# EAGLE design AccessControl (EAGLE 7.7.0)
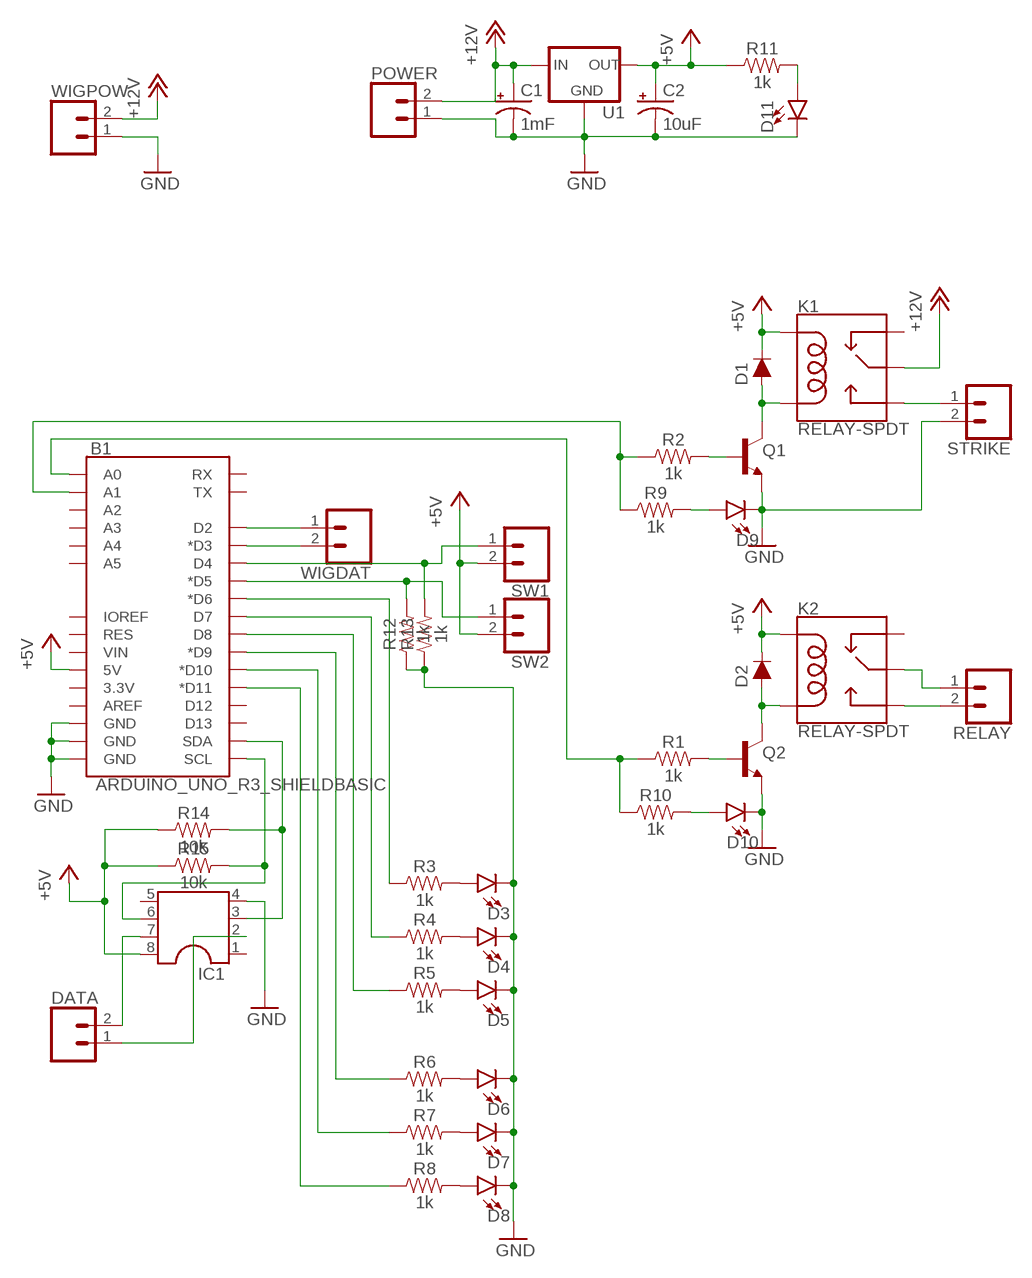
[diagram p0: schematic, sheet 1]

## Parts
B1  ARDUINO_UNO_R3_SHIELDBASIC  [UNO_R3_SHIELD]
C1  1mF  1000UF-RADIAL-5MM-25V-20%  [CPOL-RADIAL-5MM-10MM]
C2  10uF  10UF-POLAR-RADIAL-2.5MM-25V-20%  [CPOL-RADIAL-2.5MM-5MM]
D1  DIODE-KIT2  [DIODE-1N4001-KIT]
D2  DIODE-KIT2  [DIODE-1N4001-KIT]
D3  LED5MM  [LED_5MM]
D4  LED5MM  [LED_5MM]
D5  LED5MM  [LED_5MM]
D6  LED5MM  [LED_5MM]
D7  LED5MM  [LED_5MM]
D8  LED5MM  [LED_5MM]
D9  LED5MM  [LED_5MM]
D10  LED5MM  [LED_5MM]
D11  LED5MM  [LED_5MM]
DATA  CONN_025MM  [SCREWTERMINAL-5MM-2]
IC1  DIL8  [DIL08]
K1  RELAY-SPDT  RELAY-SPDT-JZC-11F  [RELAY-JZC]
K2  RELAY-SPDT  RELAY-SPDT-JZC-11F  [RELAY-JZC]
POWER  CONN_025MM  [SCREWTERMINAL-5MM-2]
Q1  TRANS_NPN-P2N2222A  [TO-92]
Q2  TRANS_NPN-P2N2222A  [TO-92]
R1  1k  1KOHM-VERT-1/6W-5%  [AXIAL-0.1]
R2  1k  1KOHM-VERT-1/6W-5%  [AXIAL-0.1]
R3  1k  1KOHM-VERT-1/6W-5%  [AXIAL-0.1]
R4  1k  1KOHM-VERT-1/6W-5%  [AXIAL-0.1]
R5  1k  1KOHM-VERT-1/6W-5%  [AXIAL-0.1]
R6  1k  1KOHM-VERT-1/6W-5%  [AXIAL-0.1]
R7  1k  1KOHM-VERT-1/6W-5%  [AXIAL-0.1]
R8  1k  1KOHM-VERT-1/6W-5%  [AXIAL-0.1]
R9  1k  1KOHM-VERT-1/6W-5%  [AXIAL-0.1]
R10  1k  1KOHM-VERT-1/6W-5%  [AXIAL-0.1]
R11  1k  1KOHM-VERT-1/6W-5%  [AXIAL-0.1]
R12  1k  1KOHM-VERT-1/6W-5%  [AXIAL-0.1]
R13  1k  1KOHM-VERT-1/6W-5%  [AXIAL-0.1]
R14  10k  10KOHM-VERT-1/6W-5%  [AXIAL-0.1]
R15  10k  10KOHM-VERT-1/6W-5%  [AXIAL-0.1]
RELAY  CONN_025MM  [SCREWTERMINAL-5MM-2]
STRIKE  CONN_025MM  [SCREWTERMINAL-5MM-2]
SW1  CONN_025MM  [SCREWTERMINAL-5MM-2]
SW2  CONN_025MM  [SCREWTERMINAL-5MM-2]
U1  V_REG_78XXSINK  [TO220-IGO]
WIGDAT  CONN_025MM  [SCREWTERMINAL-5MM-2]
WIGPOW  CONN_025MM  [SCREWTERMINAL-5MM-2]

## Nets
+5V: B1.5V C2.1(+) D1.C D2.C IC1.8 K1.5(COIL1) K2.5(COIL1) R11.P$1 R14.P$1 R15.P$1 SW1.2 SW2.2 U1.OUT
+12V: C1.+ K1.4(MAIN) POWER.2 U1.IN WIGPOW.2
GND: B1.GND@0(GND) B1.GND@1(GND) B1.GND@2(GND) C1.- C2.2(-) D3.K(C) D4.K(C) D5.K(C) D6.K(C) D7.K(C) D8.K(C) D9.K(C) D10.K(C) D11.K(C) IC1.4 POWER.1 Q1.3(E) Q2.3(E) R12.P$1 R13.P$1 STRIKE.2 U1.GND WIGPOW.1
N$1: D1.A K1.1(COIL2) Q1.1(C)
N$2: Q1.2(B) R2.P$2
N$3: D2.A K2.1(COIL2) Q2.1(C)
N$4: Q2.2(B) R1.P$2
N$5: K2.3(NO) RELAY.2
N$6: K2.4(MAIN) RELAY.1
N$7: K1.3(NO) STRIKE.1
N$8: B1.D2 WIGDAT.1
N$9: B1.D3(*D3) WIGDAT.2
N$10: B1.A0 R1.P$1 R10.P$1
N$11: B1.A1 R2.P$1 R9.P$1
N$12: D3.A R3.P$2
N$13: D4.A R4.P$2
N$14: D5.A R5.P$2
N$15: D6.A R6.P$2
N$16: D7.A R7.P$2
N$17: D8.A R8.P$2
N$18: D11.A R11.P$2
N$19: D9.A R9.P$2
N$20: D10.A R10.P$2
N$21: B1.D6(*D6) R3.P$1
N$22: B1.D7 R4.P$1
N$23: B1.D8 R5.P$1
N$24: B1.D9(*D9) R6.P$1
N$25: B1.D10(*D10) R7.P$1
N$26: B1.D11(*D11) R8.P$1
N$27: B1.SDA IC1.3 R14.P$2
N$28: B1.D4 R13.P$2 SW1.1
N$29: B1.D5(*D5) R12.P$2 SW2.1
N$30: B1.SCL IC1.6 R15.P$2
N$33: DATA.2 IC1.7
N$34: DATA.1 IC1.2
Unconnected: B1.3.3V B1.A2 B1.A3 B1.A4 B1.A5 B1.AREF B1.D12 B1.D13 B1.IOREF B1.RES B1.RX B1.TX B1.VIN IC1.1 IC1.5 K1.2(NC) K2.2(NC)

## Library data of the parts
B1 = SparkFun-Boards:ARDUINO_UNO_R3_SHIELD: Arduino R3 Shield Footprint Shield form compatible with the Arduino Uno R3. SparkFun Products: MG2639 Cellular Shield <https://www.sparkfun.com/products/13120> MIDI Shield <https://www.sparkfun.com/products/12898> R3 Stackable Headers Kit <https://www.sparkfun.com/products/11417>
C1 = SparkFun-Capacitors:1000UF: 1,000µF/1mF ceramic capacitors A capacitor is a passive two-terminal electrical component used to store electrical energy temporarily in an electric field. CAP-08070; PROD_ID: CAP-09538
C2 = SparkFun-Capacitors:10UF-POLAR: 10.0µF polarized capacitors A capacitor is a passive two-terminal electrical component used to store electrical energy temporarily in an electric field.; PROD_ID: CAP-08440
D1 D2 = SparkFun-DiscreteSemi:DIODE: Diode These are standard reverse protection diodes and small signal diodes. SparkFun Products: SparkFun SparkPunk Sound Kit <https://www.sparkfun.com/products/11177> SparkFun ESP8266 Thing <https://www.sparkfun.com/products/13231>; PROD_ID: DIO-09176; VALUE: 1A/50V/1.1V
D3-D11 = SparkFun-LED:LED: LED (Generic) Standard schematic elements and footprints for 5mm, 3mm, 1206, and 0603 sized LEDs. Generic LEDs with no color specified.
DATA POWER RELAY STRIKE SW1 SW2 WIGDAT WIGPOW = SparkFun-Connectors:CONN_02: Multi connection point. Often used as Generic Header-pin footprint for 0.1 inch spaced/style header connections On any of the 0.1 inch spaced packages, you can populate with these: Break Away Headers - Straight <https://www.sparkfun.com/products/116> (PRT-00116) Break Away Male Headers - Right Angle <https://www.sparkfun.com/products/553> (PRT-00553) Female Headers <https://www.sparkfun.com/products/115> (PRT-00115) Break Away Headers - Machine Pin <https://www.sparkfun.com/products/117> (PRT-00117) Break Away Female Headers - Swiss Machine Pin <https://www.sparkfun.com/products/743> (PRT-00743) For SCREWTERMINALS and SPRING TERMINALS visit here: Screw Terimnals on SparkFun.com <https://www.sparkfun.com/search/results?term=Screw+Terminals> (5mm/3.5mm/2.54mm spacing) This device is also useful as a general connection point to wire up your design to another part of your project. Our various solder wires solder well into these plated through hole pads. Hook-Up Wire - Assortment (Stranded, 22 AWG) <https://www.sparkfun.com/products/11375> (PRT-11375) Hook-Up Wire - Assortment (Solid Core, 22 AWG) <https://www.sparkfun.com/products/11367> (PRT-11367) View the entire wire category on our website here <https://www.sparkfun.com/categories/141> Special notes: Molex polarized connector foot print use with: PRT-08233 with associated crimp pins and housings. 2.54_SCREWTERM for use with PRT-10571. 3.5mm Screw Terminal footprints for PRT-08084 5mm Screw Terminal footprints for use with PRT-08432; SF_SKU: PRT-08432
IC1 = ic-package:DIL8: Dual In Line / Socket
K1 K2 = SparkFun-Electromechanical:RELAY-SPDT: SPDT Electromechanical Relay Single-pole, double-throw sealed relays. When current is applied to the coil, it throws a simple changeover switch, terminating the connection from the NC contact to ground and closing the NO contact. Use them to switch high voltage/high current devices. SparkFun Products JQX-15F: Relay SPDT Sealed - 20A <https://www.sparkfun.com/products/10924> (COM-10924) JZC-11F: Relay SPDT Sealed <https://www.sparkfun.com/products/100> (COM-00100); PROD_ID: COMP-09533; SF_SKU: COM-00100
Q1 Q2 = SparkFun-DiscreteSemi:TRANS_NPN: NPN transistor Current controlled devices typically used to amplify current or used as a switch. BC547 - COM-08928 <http://www.sparkfun.com/products/8928> (TO-92 45V 100mA) (1.Collector 2.Base 3.Emitter) 2N3904 - COM-00521 <http://www.sparkfun.com/products/521> (TO-92 40V 200mA) (1.Emitter 2.Base 3.Collector) P2N2222A - COM-12852 <http://www.sparkfun.com/products/12852> (TO-92 40V 600mA) (1.Collector 2.Base 3.Emitter); PROD_ID: TRANS-09536; VALUE: 600mA/40V
R1-R13 = SparkFun-Resistors:1KOHM: 1kΩ resistor A resistor is a passive two-terminal electrical component that implements electrical resistance as a circuit element. Resistors act to reduce current flow, and, at the same time, act to lower voltage levels within circuits. - Wikipedia; PROD_ID: RES-09769
R14 R15 = SparkFun-Resistors:10KOHM: 10kΩ resistor A resistor is a passive two-terminal electrical component that implements electrical resistance as a circuit element. Resistors act to reduce current flow, and, at the same time, act to lower voltage levels within circuits. - Wikipedia; PROD_ID: RES-08375
U1 = SparkFun-IC-Power:V_REG_78XX: Voltage Regulator Standard 78xx regulator. IGO (Input Ground Output). Spark Fun Electronics SKU : COM-00107

## Board
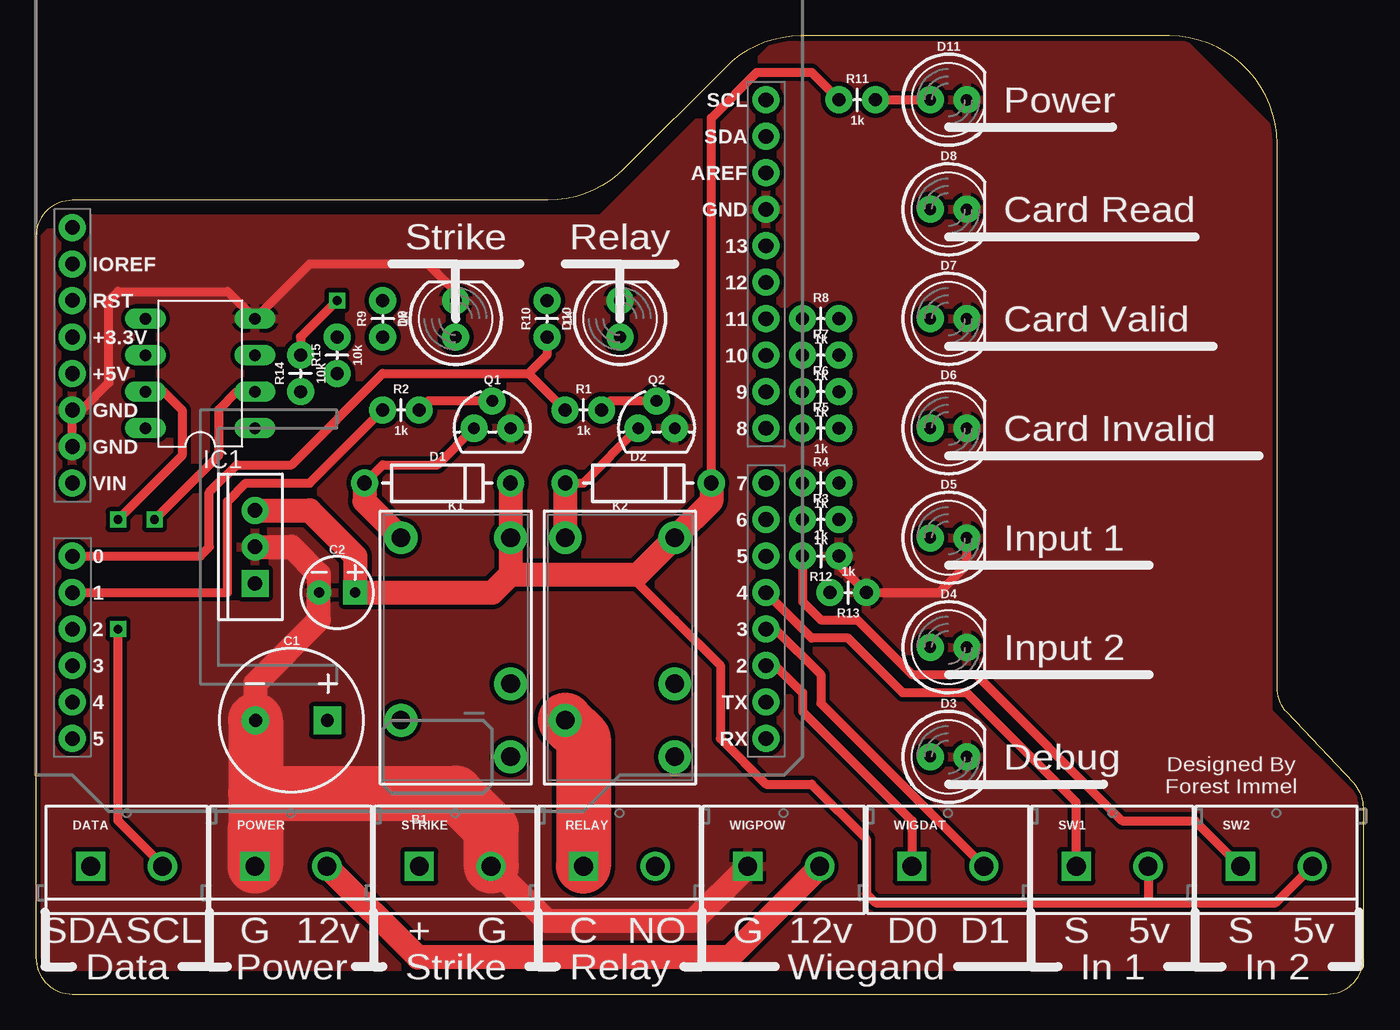
[diagram p1: board, top side]
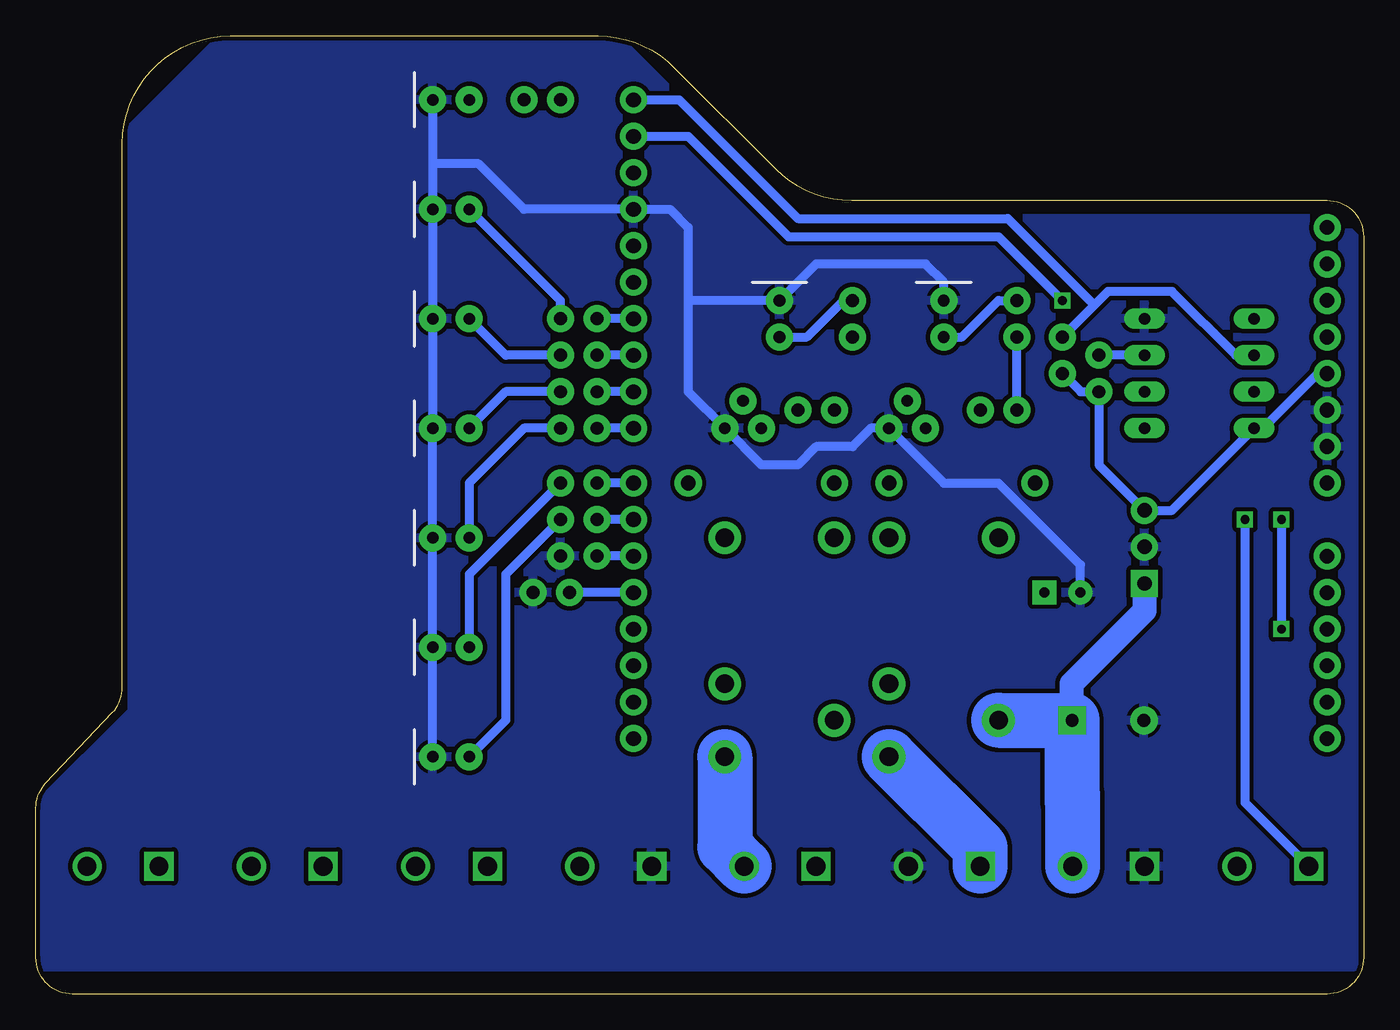
[diagram p2: board, bottom side, seen from below]

Size 92.38 x 66.67 mm. Coordinates in mm from the lower left corner, seen from the top.
Outline: 35.63,55.23 2.54,55.23 arc90 0,52.7 0,2.54 arc90 2.54,0 89.84,0 arc90 92.38,2.54 92.38,12.95 arc43 91.69,14.7 87.06,19.59 arc-43 86.36,21.33 86.36,59.17 arc90 78.86,66.67 53.27,66.67 arc45 47.97,64.48 40.93,57.43 arc-45 35.63,55.23
Copper layers (1*16): Top 0.035mm / dielectric 1.5mm / Bottom 0.035mm
Design rules "SparkFun": minimum track width 8mil, minimum drill 20mil, track to track 8mil, track to pad 8mil, pad to pad 8mil, via to via 8mil, smd to smd 8mil, copper to edge 10mil, drill to drill 8mil, minimum pad ring 12mil, minimum via ring 10mil, stop-mask expansion 4mil, vias tented up to drill 25mil, thermal gap 10mil

### Footprints (pad centres in the part's own frame; a part is rotated, then mirrored left to right if it is on the bottom)
UNO_R3_SHIELD = drill 1.016 pad 1.88: 3.3V 24.13,-2.54; 5V 24.13,0; A0 24.13,12.7; A1 24.13,15.24; A2 24.13,17.78; A3 24.13,20.32; A4 24.13,22.86; A5 24.13,25.4; AREF -24.13,-13.97; D2 -24.13,20.32; D3 -24.13,17.78; D4 -24.13,15.24; D5 -24.13,12.7; D6 -24.13,10.16; D7 -24.13,7.62; D8 -24.13,3.81; D9 -24.13,1.27; D10 -24.13,-1.27; D11 -24.13,-3.81; D12 -24.13,-6.35; D13 -24.13,-8.89; GND@0 24.13,2.54; GND@1 24.13,5.08; GND@2 -24.13,-11.43; IOREF 24.13,-7.62; NC 24.13,-10.16; RES 24.13,-5.08; RX -24.13,25.4; SCL -24.13,-19.05; SDA -24.13,-16.51; TX -24.13,22.86; VIN 24.13,7.62
CPOL-RADIAL-5MM-10MM = drill 0.9 pad 1.93 square: + 2.5,0 | drill 0.9 pad 1.93: - -2.5,0
CPOL-RADIAL-2.5MM-5MM = drill 0.7 pad 1.651 square: 1 1.25,0 | drill 0.7 pad 1.651: 2 -1.25,0
DIODE-1N4001-KIT = drill 1.016 pad 1.88: A -5.08,0; C 5.08,0
LED_5MM = drill 0.813 pad 1.88: A -1.27,0; K 1.27,0
SCREWTERMINAL-5MM-2 = drill 1.3 pad 2.032 square: 1 0,0 | drill 1.3 pad 2.032: 2 5,0
DIL08 = drill 0.813 long: 1 -3.81,-3.81; 2 -1.27,-3.81; 3 1.27,-3.81; 4 3.81,-3.81; 5 3.81,3.81; 6 1.27,3.81; 7 -1.27,3.81; 8 -3.81,3.81
RELAY-JZC = drill 1.3 pad 2.286: 1 3.81,-8.89; 2 -3.81,1.27; 3 -3.81,6.35; 4 3.81,3.81; 5 -3.81,-8.89
TO-92 = drill 0.813 pad 1.88: 1 -1.27,0; 2 0,1.905; 3 1.27,0
AXIAL-0.1 = drill 0.9 pad 1.88: P$1 -1.27,0; P$2 1.27,0
TO220-IGO = drill 1 pad 1.88: GND 0,0; OUT 2.54,0 | drill 1 pad 1.88 square: IN -2.54,0

### Placement (x,y rotation side)
B1  26.67,43.18 180 top
C1  17.78,19.05 0 top
C2  20.95,27.94 0 top
D1  27.94,35.56 0 top
D2  41.91,35.56 0 top
D3  63.5,16.51 0 top
D4  63.5,24.13 0 top
D5  63.5,31.75 0 top
D6  63.5,39.37 0 top
D7  63.5,46.99 0 top
D8  63.5,54.61 0 top
D9  29.21,46.99 90 top
D10  40.64,46.99 90 top
D11  63.5,62.23 0 top
DATA  3.81,8.89 0 top
IC1  11.43,43.18 90 top
K1  29.21,22.86 180 top
K2  40.64,22.86 180 top
POWER  15.24,8.89 0 top
Q1  31.75,39.37 0 top
Q2  43.18,39.37 0 top
R1  38.1,40.64 0 top
R2  25.4,40.64 0 top
R3  54.61,33.02 0 top
R4  54.61,35.56 0 top
R5  54.61,39.37 0 top
R6  54.61,41.91 0 top
R7  54.61,44.45 0 top
R8  54.61,46.99 0 top
R9  24.13,46.99 90 top
R10  35.56,46.99 90 top
R11  57.15,62.23 0 top
R12  54.61,30.48 180 top
R13  56.52,27.94 180 top
R14  18.41,43.18 90 top
R15  20.95,44.45 90 top
RELAY  38.1,8.89 0 top
STRIKE  26.67,8.89 0 top
SW1  72.39,8.89 0 top
SW2  83.82,8.89 0 top
U1  15.24,31.11 90 top
WIGDAT  60.96,8.89 0 top
WIGPOW  49.53,8.89 0 top

### Tracks (layer width: path | path; a pad name or v marks a point on that pad's centre or on a via)
+5V
  Top 0.61: 77.47,6.35 58.42,6.35 57.78,6.99 57.78,10.79 53.98,14.61 50.8,14.61 47.62,17.78 47.62,22.86 44.45,26.04 44.43,26.04 41.27,29.19 | 77.47,6.35 86.28,6.35 SW2.2 | SW1.2 77.39,6.43 77.47,6.35 | D2.C 46.99,60.96 50.16,64.14 53.98,64.14 R11.P$1
  Top 1.676: 33.02,29.19 41.27,29.19 41.89,29.19 K2.5 46.99,34.29 D2.C | 33.02,29.19 K1.5 D1.C | U1.OUT 19.05,33.66 22.23,30.48 22.23,27.96 C2.1 31.77,27.94 33.02,29.19
  Bottom 0.61: B1.5V 3.17,43.18 6.99,39.37 IC1.8 13.34,33.66 U1.OUT 18.41,36.83 R14.P$1 19.68,41.91 R15.P$1
+12V
  Top 1.676: WIGPOW.2 54.53,8.81 48.26,2.54 26.59,2.54 POWER.2
  Bottom 1.676: U1.IN 15.24,26.67 20.32,21.59 20.32,19.09 C1.+
  Bottom 3.81: POWER.2 20.24,13.34 | 20.24,13.34 20.24,13.89 | 20.24,13.34 20.28,13.38 C1.+ K1.4
GND
  Top 0.61: B1.GND@1 B1.GND@0 3.17,40.64 5.08,42.55 5.08,48.26 5.71,48.9 13.34,48.9 IC1.4 19.05,50.8 27.3,50.8 29.21,48.9 D9.K | R12.P$1 55.88,29.84 R13.P$1 62.87,27.94 64.77,29.84 D5.K
  Top 1.676: STRIKE.2 31.75,8.89 35.56,5.08 45.72,5.08 WIGPOW.1 | C1.- 15.28,21.63 19.68,26.04 19.68,27.92 C2.2 19.68,27.96 19.68,29.21 17.78,31.11 U1.GND
  Top 3.81: STRIKE.2 31.67,11.51 29.21,13.97 15.28,13.97 | 15.24,11.43 POWER.1 15.28,8.93 15.28,13.97 | C1.- 15.28,13.97
  Bottom 0.61: 46.99,48.26 46.99,53.34 48.26,54.61 B1.GND@2 58.42,54.61 61.59,57.78 64.77,57.78 | 46.99,48.26 46.99,41.91 Q2.3 41.91,36.83 39.37,36.83 38.1,38.1 35.56,38.1 34.29,39.37 Q1.3 29.21,35.56 25.4,35.56 19.7,29.86 C2.2 | D3.K D4.K D5.K D6.K D7.K D8.K 64.77,57.78 | D11.K 64.77,57.78 | 46.99,48.26 D10.K 38.1,50.8 30.48,50.8 29.21,49.53 D9.K
  pour Top (isolate 0.305): 0.64,1.91 0.64,52.7 1.91,53.98 39.37,53.98 50.16,64.77 51.44,66.04 80.01,66.04 85.72,60.33 85.72,19.68 92.08,13.34 92.08,2.54 91.44,1.91
  pour Bottom (isolate 0.305): 0.64,1.91 0.64,52.7 1.91,53.98 39.37,53.98 51.44,66.04 80.01,66.04 85.72,60.33 85.72,19.68 92.08,13.34 92.08,1.91
N$1
  Top 0.61: D1.A 24.13,36.83 27.94,36.83 Q1.1
  Top 1.676: D1.A 22.86,34.29 K1.1
N$2
  Top 0.61: Q1.2 27.3,41.27 R2.P$2
N$3
  Top 0.61: D2.A 38.1,35.56 Q2.1
  Top 1.676: D2.A K2.1
N$4
  Top 0.61: Q2.2 40.01,41.27 R1.P$2
N$5
  Bottom 3.81: K2.3 44.45,10.24 RELAY.2
N$6
  Top 3.81: K2.4 38.1,17.78 RELAY.1
N$7
  Bottom 3.81: STRIKE.1 26.67,10.16 K1.3
N$8
  Top 0.61: B1.D2 51.44,22.86 53.34,20.95 53.34,19.68 60.96,12.06 WIGDAT.1
N$9
  Top 0.61: B1.D3 51.44,25.4 54.61,22.23 54.61,20.24 WIGDAT.2
N$10
  Top 0.61: 34.29,43.18 R1.P$1 | R10.P$1 35.56,44.45 34.29,43.18 | B1.A0 11.43,30.48 12.06,31.11 12.06,34.92 13.97,36.83 17.78,36.83 24.13,43.18 34.29,43.18
N$11
  Top 0.61: B1.A1 13.34,27.94 13.34,34.29 14.61,35.56 19.05,35.56 R2.P$1
  Bottom 0.61: R2.P$1 R9.P$1
N$12
  Bottom 0.61: R3.P$2 59.69,29.21 59.69,19.05 D3.A
N$13
  Bottom 0.61: R4.P$2 62.23,29.21 D4.A
N$14
  Bottom 0.61: R5.P$2 58.42,39.37 62.23,35.56 D5.A
N$15
  Bottom 0.61: R6.P$2 59.69,41.91 D6.A
N$16
  Bottom 0.61: R7.P$2 59.69,44.45 D7.A
N$17
  Bottom 0.61: R8.P$2 55.88,48.26 D8.A
N$18
  Top 0.61: R11.P$2 D11.A
N$19
  Bottom 0.61: D9.A 27.94,45.72 25.4,48.26 R9.P$2
N$20
  Bottom 0.61: D10.A 38.73,45.72 36.2,48.26 R10.P$2
N$21
  Bottom 0.61: B1.D6 R3.P$1
N$22
  Bottom 0.61: B1.D7 R4.P$1
N$23
  Bottom 0.61: B1.D8 R5.P$1
N$24
  Bottom 0.61: B1.D9 R6.P$1
N$25
  Bottom 0.61: B1.D10 R7.P$1
N$26
  Bottom 0.61: B1.D11 R8.P$1
N$27  (via drill 0.6)
  Top 0.61: v20.95,48.26 18.41,45.72 R14.P$2
  Bottom 0.61: IC1.3 R14.P$2 | B1.SDA 46.99,59.69 40.01,52.7 25.4,52.7 v20.95,48.26
N$28
  Top 0.61: SW1.1 72.39,13.34 64.77,20.95 60.33,20.95 56.52,24.77 53.98,24.77 B1.D4
  Bottom 0.61: B1.D4 R13.P$2
N$29
  Top 0.61: R12.P$2 53.34,27.3 54.61,26.04 57.15,26.04 60.96,22.23 65.41,22.23 75.56,12.06 80.64,12.06 SW2.1
  Bottom 0.61: B1.D5 R12.P$2
N$30
  Bottom 0.61: IC1.6 8.89,44.45 13.34,48.9 17.78,48.9 18.73,47.94 | 18.73,47.94 R15.P$2 | B1.SCL 47.62,62.23 39.37,53.98 24.77,53.98 18.73,47.94
N$33  (via drill 0.6)
  Top 0.61: IC1.7 8.89,41.91 10.16,40.64 10.16,37.47 v5.71,33.02 | DATA.2 8.81,8.97 5.71,12.06 v5.71,25.4
  Bottom 0.61: v5.71,33.02 v5.71,25.4
N$34  (via drill 0.6)
  Top 0.61: IC1.2 13.97,41.91 12.7,40.64 12.7,37.47 v8.26,33.02
  Bottom 0.61: v8.26,33.02 8.26,13.34 DATA.1

### Text on the board
_tsilk: Power | Card Read | Strike | Relay | Card Valid | Card Invalid | Input 1 | Input 2 | Debug | Designed By / Forest Immel | SDA | SCL | G | 12v | + | G | C | NO | G | 12v | D0 | D1 | S | 5v | S | 5v | Data | Power | Strike | Relay | Wiegand | In 1 | In 2